# EAGLE schematic pickupboard (EAGLE 7.5.0)
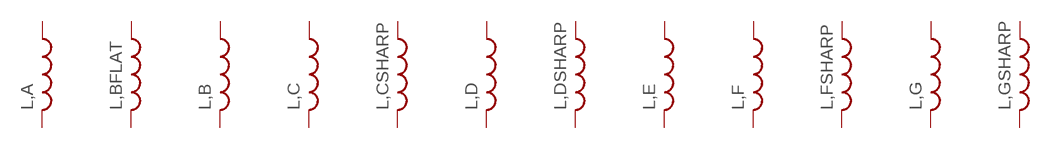
[diagram p0: schematic, sheet 1]

## Parts
L,A  L-US0204/5  [0204/5]
L,B  L-US0204/5  [0204/5]
L,BFLAT  L-US0204/5  [0204/5]
L,C  L-US0204/5  [0204/5]
L,CSHARP  L-US0204/5  [0204/5]
L,D  L-US0204/5  [0204/5]
L,DSHARP  L-US0204/5  [0204/5]
L,E  L-US0204/5  [0204/5]
L,F  L-US0204/5  [0204/5]
L,FSHARP  L-US0204/5  [0204/5]
L,G  L-US0204/5  [0204/5]
L,GSHARP  L-US0204/5  [0204/5]
Unconnected: L,A.1 L,A.2 L,B.1 L,B.2 L,BFLAT.1 L,BFLAT.2 L,C.1 L,C.2 L,CSHARP.1 L,CSHARP.2 L,D.1 L,D.2 L,DSHARP.1 L,DSHARP.2 L,E.1 L,E.2 L,F.1 L,F.2 L,FSHARP.1 L,FSHARP.2 L,G.1 L,G.2 L,GSHARP.1 L,GSHARP.2

## Library data of the parts
L,A L,B L,BFLAT L,C L,CSHARP L,D L,DSHARP L,E L,F L,FSHARP L,G L,GSHARP = resistor:L-US: INDUCTOR, American symbol